# Altium schematic sheet TivaEthernet.SchDoc
size A4
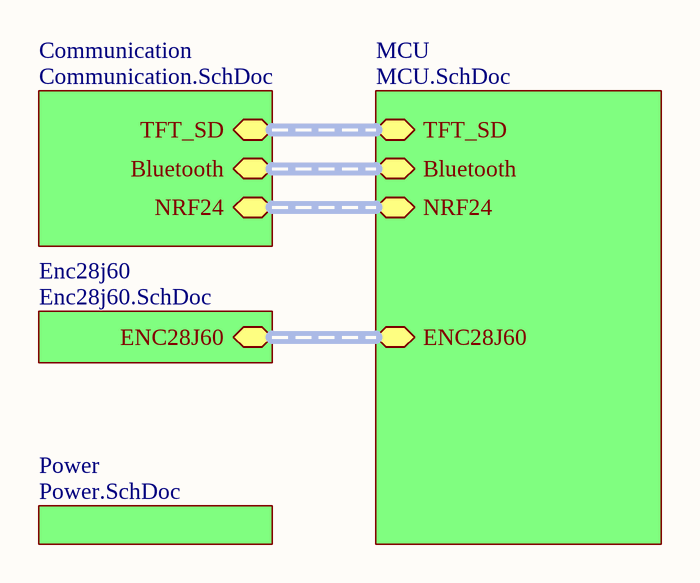
[diagram p0: TivaEthernet.SchDoc]

## Sub-sheets
Communication = Communication.SchDoc: TFT_SD (harness TFT_SD), Bluetooth (harness Bluetooth), NRF24 (harness NRF24)
Enc28j60 = Enc28j60.SchDoc: ENC28J60 (harness Enc28j60)
MCU = MCU.SchDoc: ENC28J60, TFT_SD (harness TFT_SD), Bluetooth (harness Bluetooth), NRF24 (harness NRF24)
Power = Power.SchDoc: no entries

## Buses and harness runs
harness sheet Communication/Bluetooth = sheet MCU/Bluetooth
harness sheet Communication/NRF24 = sheet MCU/NRF24
harness sheet Communication/TFT_SD = sheet MCU/TFT_SD
harness sheet Enc28j60/ENC28J60 = sheet MCU/ENC28J60